# EAGLE schematic HV Board rev5 (EAGLE 9.2.2)
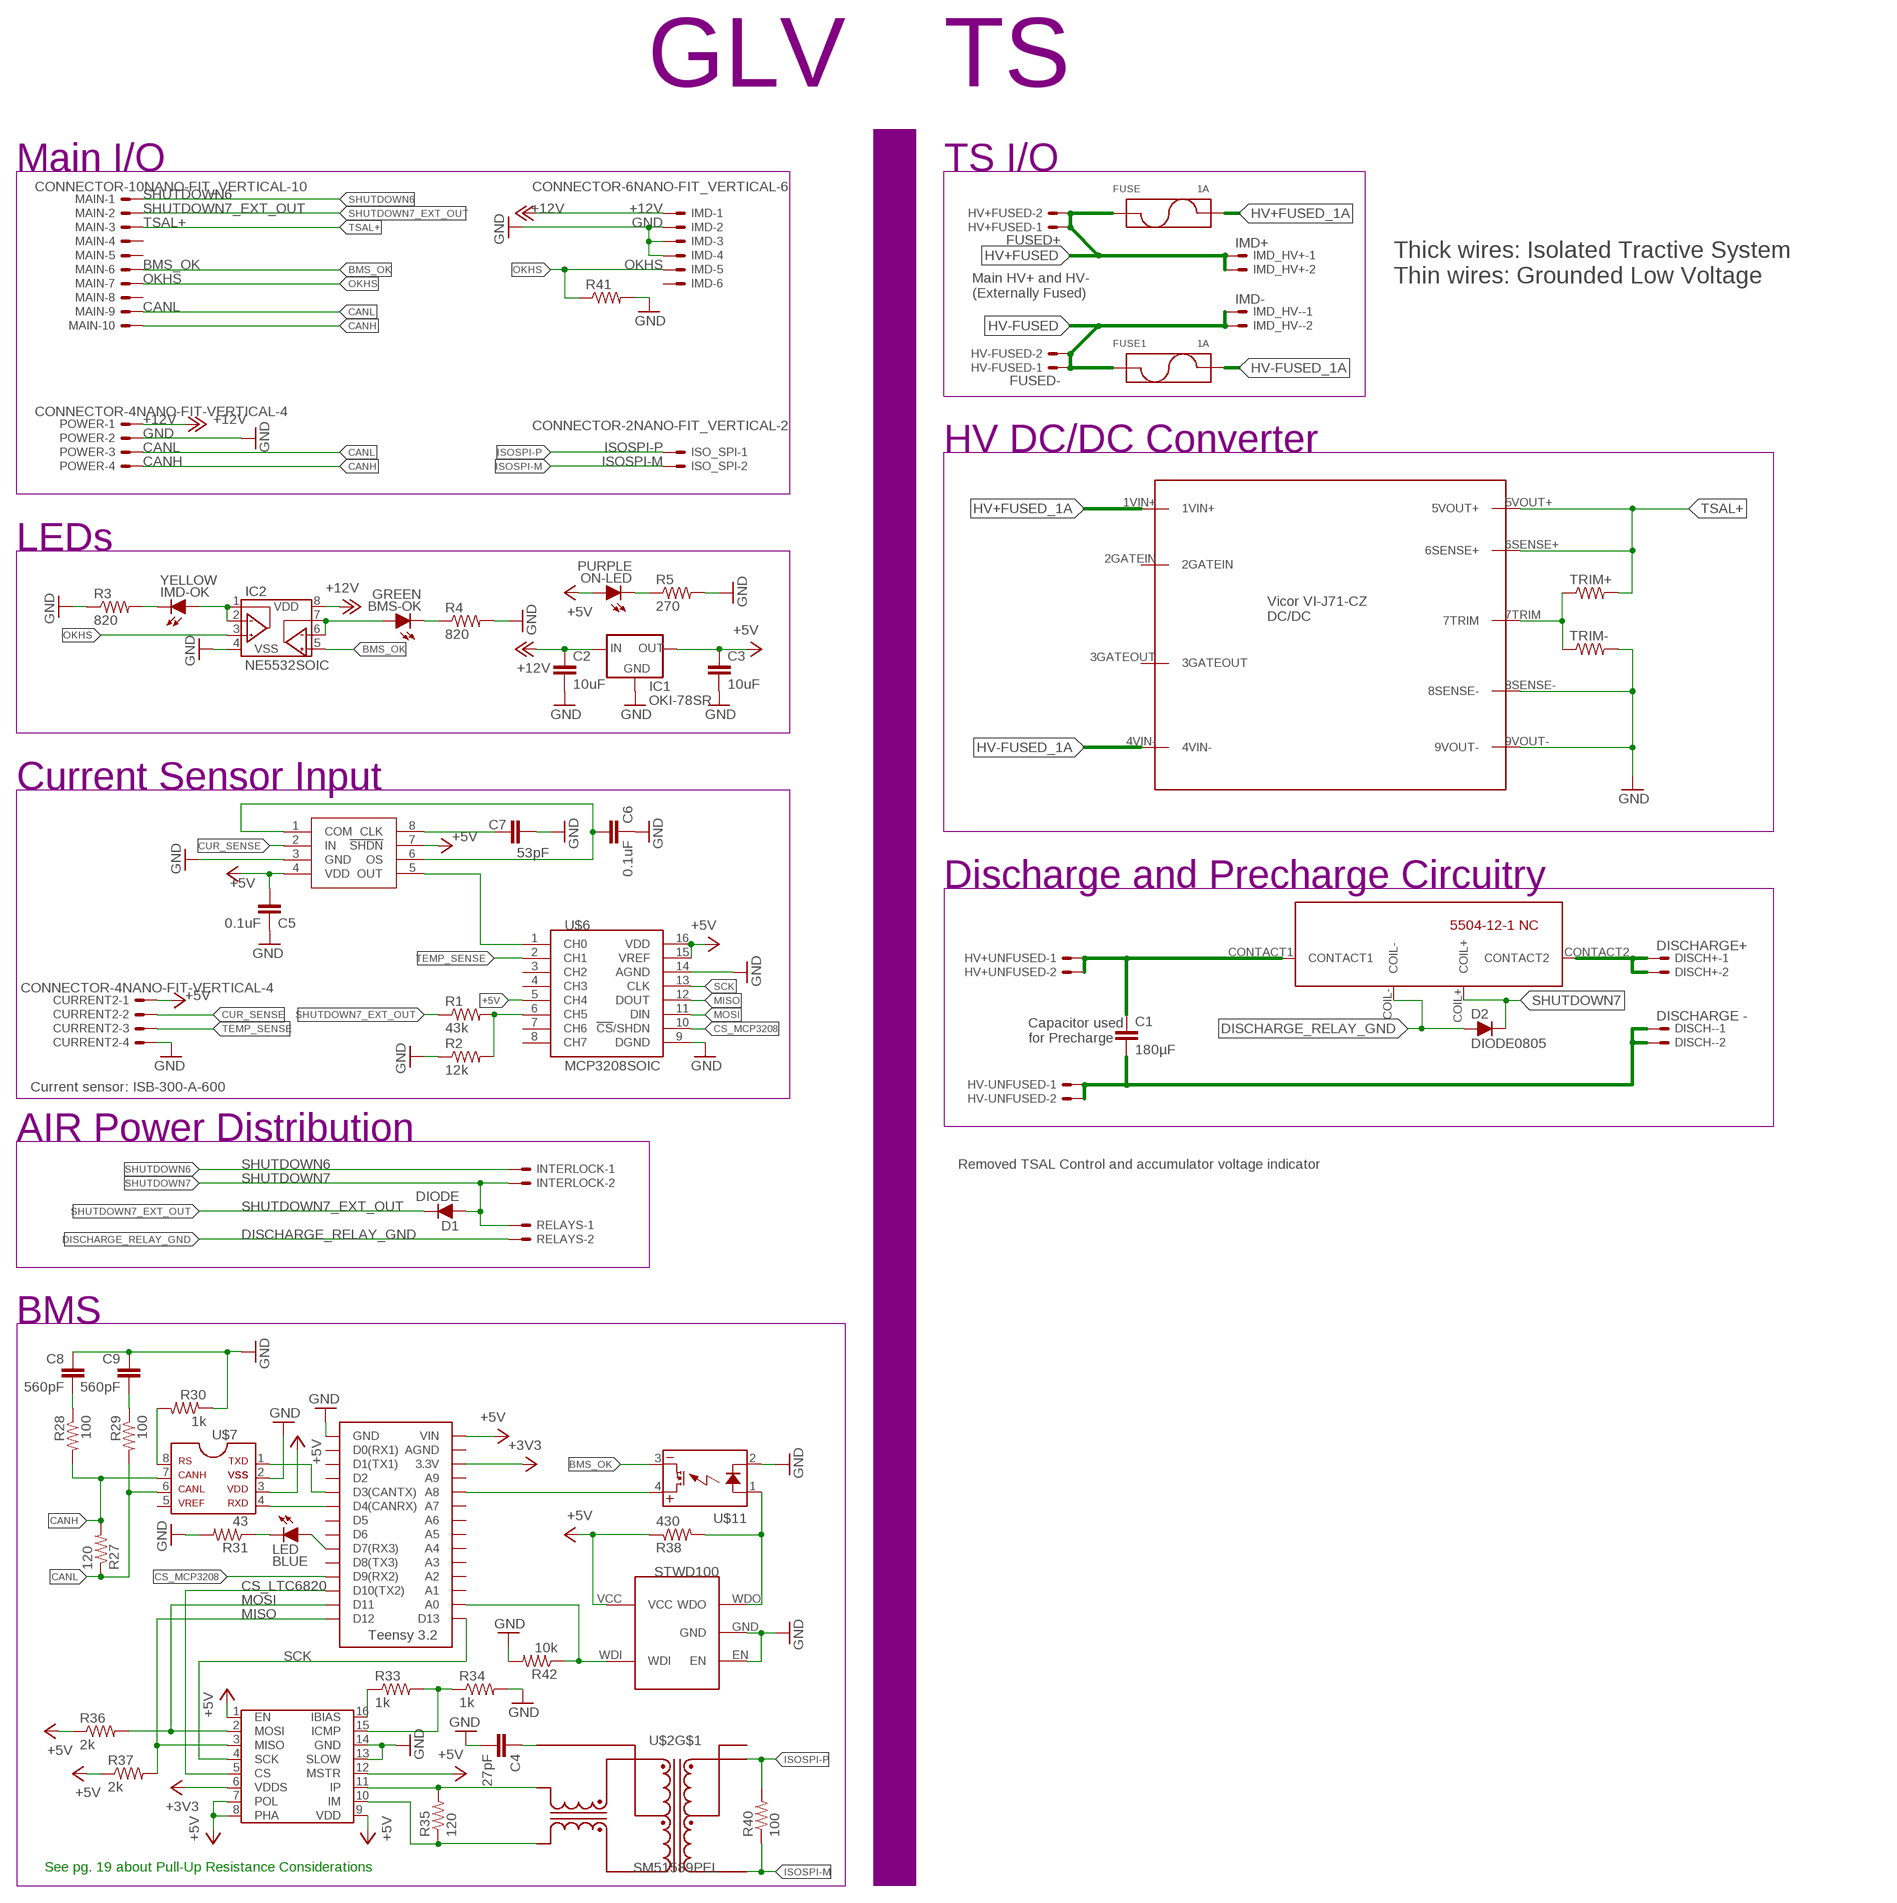
[diagram p0: schematic, sheet 1]

## Parts
BMS-OK  GREEN  LED-0805  [LED-805]
C1  180µF  CAP  [LLS2V221MELZ]
C2  10uF  CAP0805  [0805]
C3  10uF  CAP0805  [0805]
C4  27pF  CAP0805  [0805]
C5  0.1uF  CAP0805  [0805]
C6  0.1uF  CAP0805  [0805]
C7  53pF  CAP0805  [0805]
C8  560pF  CAP0805  [0805]
C9  560pF  CAP0805  [0805]
CURRENT2  CONNECTOR-4NANO-FIT-VERTICAL-4  [NANO-FIT_VERTICAL-4]
D1  DIODE  DIODEDO-41  [DO-41]
D2  DIODE0805  [0805_D]
DISCH+  DISCHARGE+  MINIFIT_5566-2  [MINIFIT_5566-2]
DISCH-  DISCHARGE -  MINIFIT_5566-2  [MINIFIT_5566-2]
FUSE  1A  FUSE_5X20MM  [0751.0110]
FUSE1  1A  FUSE_5X20MM  [0751.0110]
HV+FUSED  FUSED+  MINIFIT_5566-2  [MINIFIT_5566-2]
HV+UNFUSED  FSAE  CONNECTOR-2  [MINIFIT_5566-2]
HV-FUSED  FUSED-  MINIFIT_5566-2  [MINIFIT_5566-2]
HV-UNFUSED  HV_UNFUSED  CONNECTOR-2  [MINIFIT_5566-2]
IC1  OKI-78SR  [OKI-78SR]
IC2  NE5532SOIC  [SOIC-08]
IMD  CONNECTOR-6NANO-FIT_VERTICAL-6  [NANO-FIT_VERTICAL-6]
IMD-OK  YELLOW  LED-0805  [LED-805]
IMD_HV+  IMD+  CONNECTOR-2  [MINIFIT_5566-2]
IMD_HV-  IMD-  CONNECTOR-2  [MINIFIT_5566-2]
INTERLOCK  MINIFIT_5566-2  [MINIFIT_5566-2]
ISO_SPI  CONNECTOR-2NANO-FIT_VERTICAL-2  [NANO-FIT_VERTICAL-2]
LED  BLUE  LED-0805  [LED-805]
MAIN  CONNECTOR-10NANO-FIT_VERTICAL-10  [NANO-FIT_VERTICAL-10]
ON-LED  PURPLE  LED-0805  [LED-805]
POWER  CONNECTOR-4NANO-FIT-VERTICAL-4  [NANO-FIT_VERTICAL-4]
R1  43k  RESISTOR0805-RES  [0805]
R2  12k  RESISTOR0805-RES  [0805]
R3  820  RESISTOR0805-RES  [0805]
R4  820  RESISTOR0805-RES  [0805]
R5  270  RESISTOR0805-RES  [0805]
R27  120  RESISTOR0805-RES  [0805]
R28  100  RESISTOR0805-RES  [0805]
R29  100  RESISTOR0805-RES  [0805]
R30  1k  RESISTOR0805-RES  [0805]
R31  43  RESISTOR0805-RES  [0805]
R33  1k  RESISTOR0805-RES  [0805]
R34  1k  RESISTOR0805-RES  [0805]
R35  120  RESISTOR0805-RES  [0805]
R36  2k  RESISTOR0805-RES  [0805]
R37  2k  RESISTOR0805-RES  [0805]
R38  430  RESISTOR0805-RES  [0805]
R40  100  RESISTOR0805-RES  [0805]
R41  2k  RESISTOR0805-RES  [0805]
R42  10k  RESISTOR0805-RES  [0805]
RELAYS  MINIFIT_5566-2  [MINIFIT_5566-2]
TRIM+  RESISTOR0805-RES  [0805]
TRIM-  RESISTOR0805-RES  [0805]
U$1  MAX7480  [SOIC-08]
U$2  SM51589PEL  [SM51589PEL]
U$5  HV_DCDC_VI-J71-CZ  [HV_DCDC_VI-J71-CZ]
U$6  MCP3208SOIC  [SOIC-16]
U$7  MCP2551  [SOIC-08]
U$8  LTC6820  [MSOP-16]
U$9  TEENSY_3.2_SIMPLE  [TEENSY_3.2_SIMPLE]
U$10  STWD100  [SOT23-5]
U$11  CPC1002N  [SOP04]
U$12  5504-12-1-NC  [5504-12-1-NC]

## Nets
+3V3: U$8.6(VDDS) U$9.3.3V
+5V: C3.1 C5.1 CURRENT2.P$1 IC1.3(OUT) ON-LED.A R36.1 R37.1 R38.1 U$1.4(VDD) U$1.7(!SHDN) U$6.5(CH4) U$6.15(VREF) U$6.16(VDD) U$7.3 U$8.1(EN) U$8.7(POL) U$8.8(PHA) U$8.9(VDD) U$8.12(MSTR) U$9.VIN U$10.VCC
+12V: C2.1 IC1.1(IN) IC2.8(VDD) IMD.P$1 POWER.P$1
BMS_OK: IC2.5(VINB+) MAIN.P$6 U$11.3(DC-)
CANH: MAIN.P$10 POWER.P$4 R27.2 R28.2 U$7.7
CANL: MAIN.P$9 POWER.P$3 R27.1 R29.2 U$7.6
CS_LTC6820: U$8.5(CS) U$9.D10(TX2)
CS_MCP3208: U$6.10(!CS!/SHDN) U$9.D9(RX2)
CUR_SENSE: CURRENT2.P$2 U$1.2(IN)
DISCHARGE_RELAY_GND: D2.A RELAYS.2 U$12.COIL-
GND: C2.2 C3.2 C4.2 C5.2 C6.2 C7.2 C8.1 C9.1 CURRENT2.P$4 IC1.2(GND) IC2.4(VSS) IMD.P$2 IMD.P$3 IMD.P$4 POWER.P$2 R2.1 R3.1 R4.2 R5.2 R30.1 R31.2 R34.2 R41.2 R42.2 TRIM-.2 U$1.3(GND) U$5.8SENSE- U$5.9VOUT- U$6.9(DGND) U$6.14(AGND) U$7.2 U$8.13(SLOW) U$8.14(GND) U$9.GND U$10.EN U$10.GND U$11.2(CONTROL-)
HV+FUSED: FUSE.L1(P1) FUSE.L2(P1) HV+FUSED.1 HV+FUSED.2 IMD_HV+.1 IMD_HV+.2
HV+FUSED_1A: FUSE.R1(P2) FUSE.R2(P2) U$5.1VIN+
HV+UNFUSED_FSAE: C1.P$1 HV+UNFUSED.1 HV+UNFUSED.2 U$12.CONTACT1
HV+UNFUSED_FSAE_DISCHARGE: DISCH+.1 DISCH+.2 U$12.CONTACT2
HV-FUSED: FUSE1.L1(P1) FUSE1.L2(P1) HV-FUSED.1 HV-FUSED.2 IMD_HV-.1 IMD_HV-.2
HV-FUSED_1A: FUSE1.R1(P2) FUSE1.R2(P2) U$5.4VIN-
HV-UNFUSED_FSAE: C1.P$2 DISCH-.1 DISCH-.2 HV-UNFUSED.1 HV-UNFUSED.2
ISOSPI-M: ISO_SPI.P$2 R40.1 U$2.3(MX-)
ISOSPI-P: ISO_SPI.P$1 R40.2 U$2.2(MX+)
MISO: R37.2 U$6.12(DOUT) U$8.3(MISO) U$9.D12
MOSI: R36.2 U$6.11(DIN) U$8.2(MOSI) U$9.D11
N$1: U$1.5(OUT) U$6.1(CH0)
N$2: C6.1 U$1.1(COM) U$1.6(OS)
N$3: ON-LED.C R5.1
N$4: C7.1 U$1.8(CLK)
N$24: R1.2 R2.2 U$6.6(CH5)
N$25: U$7.1 U$9.D3(CANTX)
N$26: R30.2 U$7.8
N$27: C8.2 R28.1
N$28: C9.2 R29.1
N$29: LED.C R31.1
N$31: R33.1 U$8.16(IBIAS)
N$32: R33.2 R34.1 U$8.15(ICMP)
N$33: R35.1 U$2.22(TD-) U$8.10(IM)
N$34: R35.2 U$2.23(TD+) U$8.11(IP)
N$35: C4.1 U$2.24(TCT)
N$36: U$7.4 U$9.D4(CANRX)
N$37: LED.A U$9.D7(RX3)
N$38: R38.2 U$10.WDO U$11.1(CONTROL+)
N$40: U$9.A8 U$11.4(DC+)
N$42: IC2.1(VOUTA) IC2.2(VINA-) IMD-OK.A
N$43: BMS-OK.A IC2.6(VINB-) IC2.7(VOUTB)
N$44: BMS-OK.C R4.1
N$45: IMD-OK.C R3.2
N$50: R42.1 U$9.A0 U$10.WDI
OKHS: IC2.3(VINA+) IMD.P$5 MAIN.P$7 R41.1
SCK: U$6.13(CLK) U$8.4(SCK) U$9.D13
SHUTDOWN6: INTERLOCK.1 MAIN.P$1
SHUTDOWN7: D1.A D2.C INTERLOCK.2 RELAYS.1 U$12.COIL+
SHUTDOWN7_EXT_OUT: D1.C MAIN.P$2 R1.1
TEMP_SENSE: CURRENT2.P$3 U$6.2(CH1)
TRIM: TRIM+.1 TRIM-.1 U$5.7TRIM
TSAL+: MAIN.P$3 TRIM+.2 U$5.5VOUT+ U$5.6SENSE+
Unconnected: IMD.P$6 MAIN.P$4 MAIN.P$5 MAIN.P$8 U$2.1(MCT) U$2.4(MCT) U$2.5(MX+) U$2.6(MX-) U$2.7(MCT) U$2.8(MX+) U$2.9(MX-) U$2.10(MCT) U$2.11(MX+) U$2.12(MX-) U$2.13(TD-) U$2.14(TD+) U$2.15(TCT) U$2.16(TD-) U$2.17(TD+) U$2.18(TCT) U$2.19(TD-) U$2.20(TD+) U$2.21(TCT) U$5.2GATEIN U$5.3GATEOUT U$6.3(CH2) U$6.4(CH3) U$6.7(CH6) U$6.8(CH7) U$7.5 U$9.A1 U$9.A2 U$9.A3 U$9.A4 U$9.A5 U$9.A6 U$9.A7 U$9.A9 U$9.AGND U$9.D0(RX1) U$9.D1(TX1) U$9.D2 U$9.D5 U$9.D6 U$9.D8(TX3)

## Notes on the sheet
- GLV
- TS
- Main I/O | TS I/O
- Thick wires: Isolated Tractive System
  Thin wires: Grounded Low Voltage
- Main HV+ and HV-
  (Externally Fused)
- HV DC/DC Converter
- LEDs
- Current Sensor Input
- Discharge and Precharge Circuitry
- Capacitor used
  for Precharge
- Current sensor: ISB-300-A-600
- AIR Power Distribution
- Removed TSAL Control and accumulator voltage indicator
- BMS
- See pg. 19 about Pull-Up Resistance Considerations

## Library data of the parts
BMS-OK IMD-OK LED ON-LED = HyTechDevices:LED: Light Emitting Diode (LED) Source: Dangerous Prototypes Eagle Library <https://github.com/DangerousPrototypes/Eagle_Part_Library>
C1-C9 = HyTechDevices:CAP: Capacitor Standard 0603 ceramic capacitor, and 0.1" leaded capacitor.
CURRENT2 POWER = HyTechDevices:CONNECTOR-4: Mini-Fit Junior connector 4 pole Source: http://www.molex.com
D1 D2 = HyTechDevices:DIODE: DIODE general purpose rectifier
DISCH+ DISCH- HV+FUSED HV-FUSED INTERLOCK RELAYS = HyTechDevices:MINIFIT_5566-2: Mini-Fit Junior connector 2 pole Source: http://www.molex.com; OC_FARNELL: 1822072; OC_NEWARK: unknown
FUSE FUSE1 = HyTechDevices:FUSE: Fuse/Fuseclips Keystone Electronics 3568 Fuse Mouser Part <http://www.mouser.com/ProductDetail/Keystone-Electronics/3568> Datasheet <http://www.mouser.com/ds/2/215/568-742601.pdf> Bussman/Eaton Midget Fuse Clip 1A3400 <http://www.mouser.com/ProductDetail/Bussmann-Eaton/BK-1A3400-09-R/?qs=sGAEpiMZZMuG%252bgnN5hGYGzzlAelq2OxnKqVSMVjq8I4%3d> Schurter 0751.0110 Brass Fuse Clip Datasheet <http://www.mouser.com/ds/2/358/typ_OG__Clip__5x20-2553.pdf>
HV+UNFUSED HV-UNFUSED IMD_HV+ IMD_HV- = HyTechDevices:CONNECTOR-2: Mini-Fit Junior connector 2 pole Source: http://www.molex.com; OC_FARNELL: 1822072; OC_NEWARK: unknown
IC1 = HyTechDevices:OKI-78SR: Murata OKI-78SR Non-Isolated Switching Regulator DC/DC - Datasheet <https://power.murata.com/data/power/oki-78sr.pdf>
IC2 = HyTechDevices:NE5532: TI NE5532 Dual Channel Op Amp
IMD = HyTechDevices:CONNECTOR-6: Mini-Fit Junior connector 6 pole Source: http://www.molex.com
ISO_SPI = HyTechDevices:CONNECTOR-2: Mini-Fit Junior connector 2 pole Source: http://www.molex.com
MAIN = HyTechDevices:CONNECTOR-10: Mini-Fit Junior connector 10 pole Source: http://www.molex.com
R1-R5 R27-R31 R33-R38 R40-R42 TRIM+ TRIM- = HyTechDevices:RESISTOR: Resistor Basic schematic elements and footprints for 0603, 1206, and PTH resistors.
U$1 = HyTechDevices:MAX7480: 8th-order lowpass butterworth filter
U$2 = HyTechDevices:SM51589PEL: Bourns High Isolation LAN Transformer Module 5000 VAC Isolation Turns Ratio: 1CT:1CT Inductance: 350 uH Leakage Inductance: 0.5 uH Datasheet <http://www.mouser.com/ds/2/54/m51589pel-778121.pdf>
U$5 = HyTechDevices:HV_DCDC_VI-J71-CZ: Vicor-Corporation VI-J71-CZ Product Page <https://www.digikey.com/product-detail/en/vicor-corporation/VI-J71-CZ/1102-1486-ND/2996194> Datasheet <http://cdn.vicorpower.com/documents/datasheets/ds_vi-j00.pdf>
U$6 = HyTechDevices:MCP3208: Analog to Digital Converter
U$7 = HyTechDevices:MCP2551: MCP2551 High-Speed CAN Transceiver Product Webpage <https://www.microchip.com/wwwproducts/en/MCP2551> Datasheet <http://ww1.microchip.com/downloads/en/DeviceDoc/21667f.pdf> This device is outdated It is replaced by MCP2561. Comparison Page <https://www.microchip.com/wwwproducts/ProductCompare/MCP2551/MCP2561> Product Webpage <https://www.microchip.com/wwwproducts/en/MCP2561> Datasheet <http://ww1.microchip.com/downloads/en/DeviceDoc/20005167C.pdf>
U$8 = HyTechDevices:LTC6820: Linear Technology isoSPI Isolated Communications Interface Datasheet <http://cds.linear.com/docs/en/datasheet/6820fb.pdf>
U$9 = HyTechDevices:TEENSY_3.2_SIMPLE: Simple version of the Teensy 3.2 board that only uses the 2 main rows of pins, not the inner pins or the pins opposite the usb port.
U$10 = HyTechDevices:STWD100: STWD100 Watchdog timer
U$11 = HyTechDevices:CPC1002N: IXYS Solid State Relay .7A
U$12 = HyTechDevices:5504-12-1-NC: Relay 5504-12-1 Normally Closed(Form B)